# EAGLE design tracking-mode-analog-design (EAGLE 9.6.2)
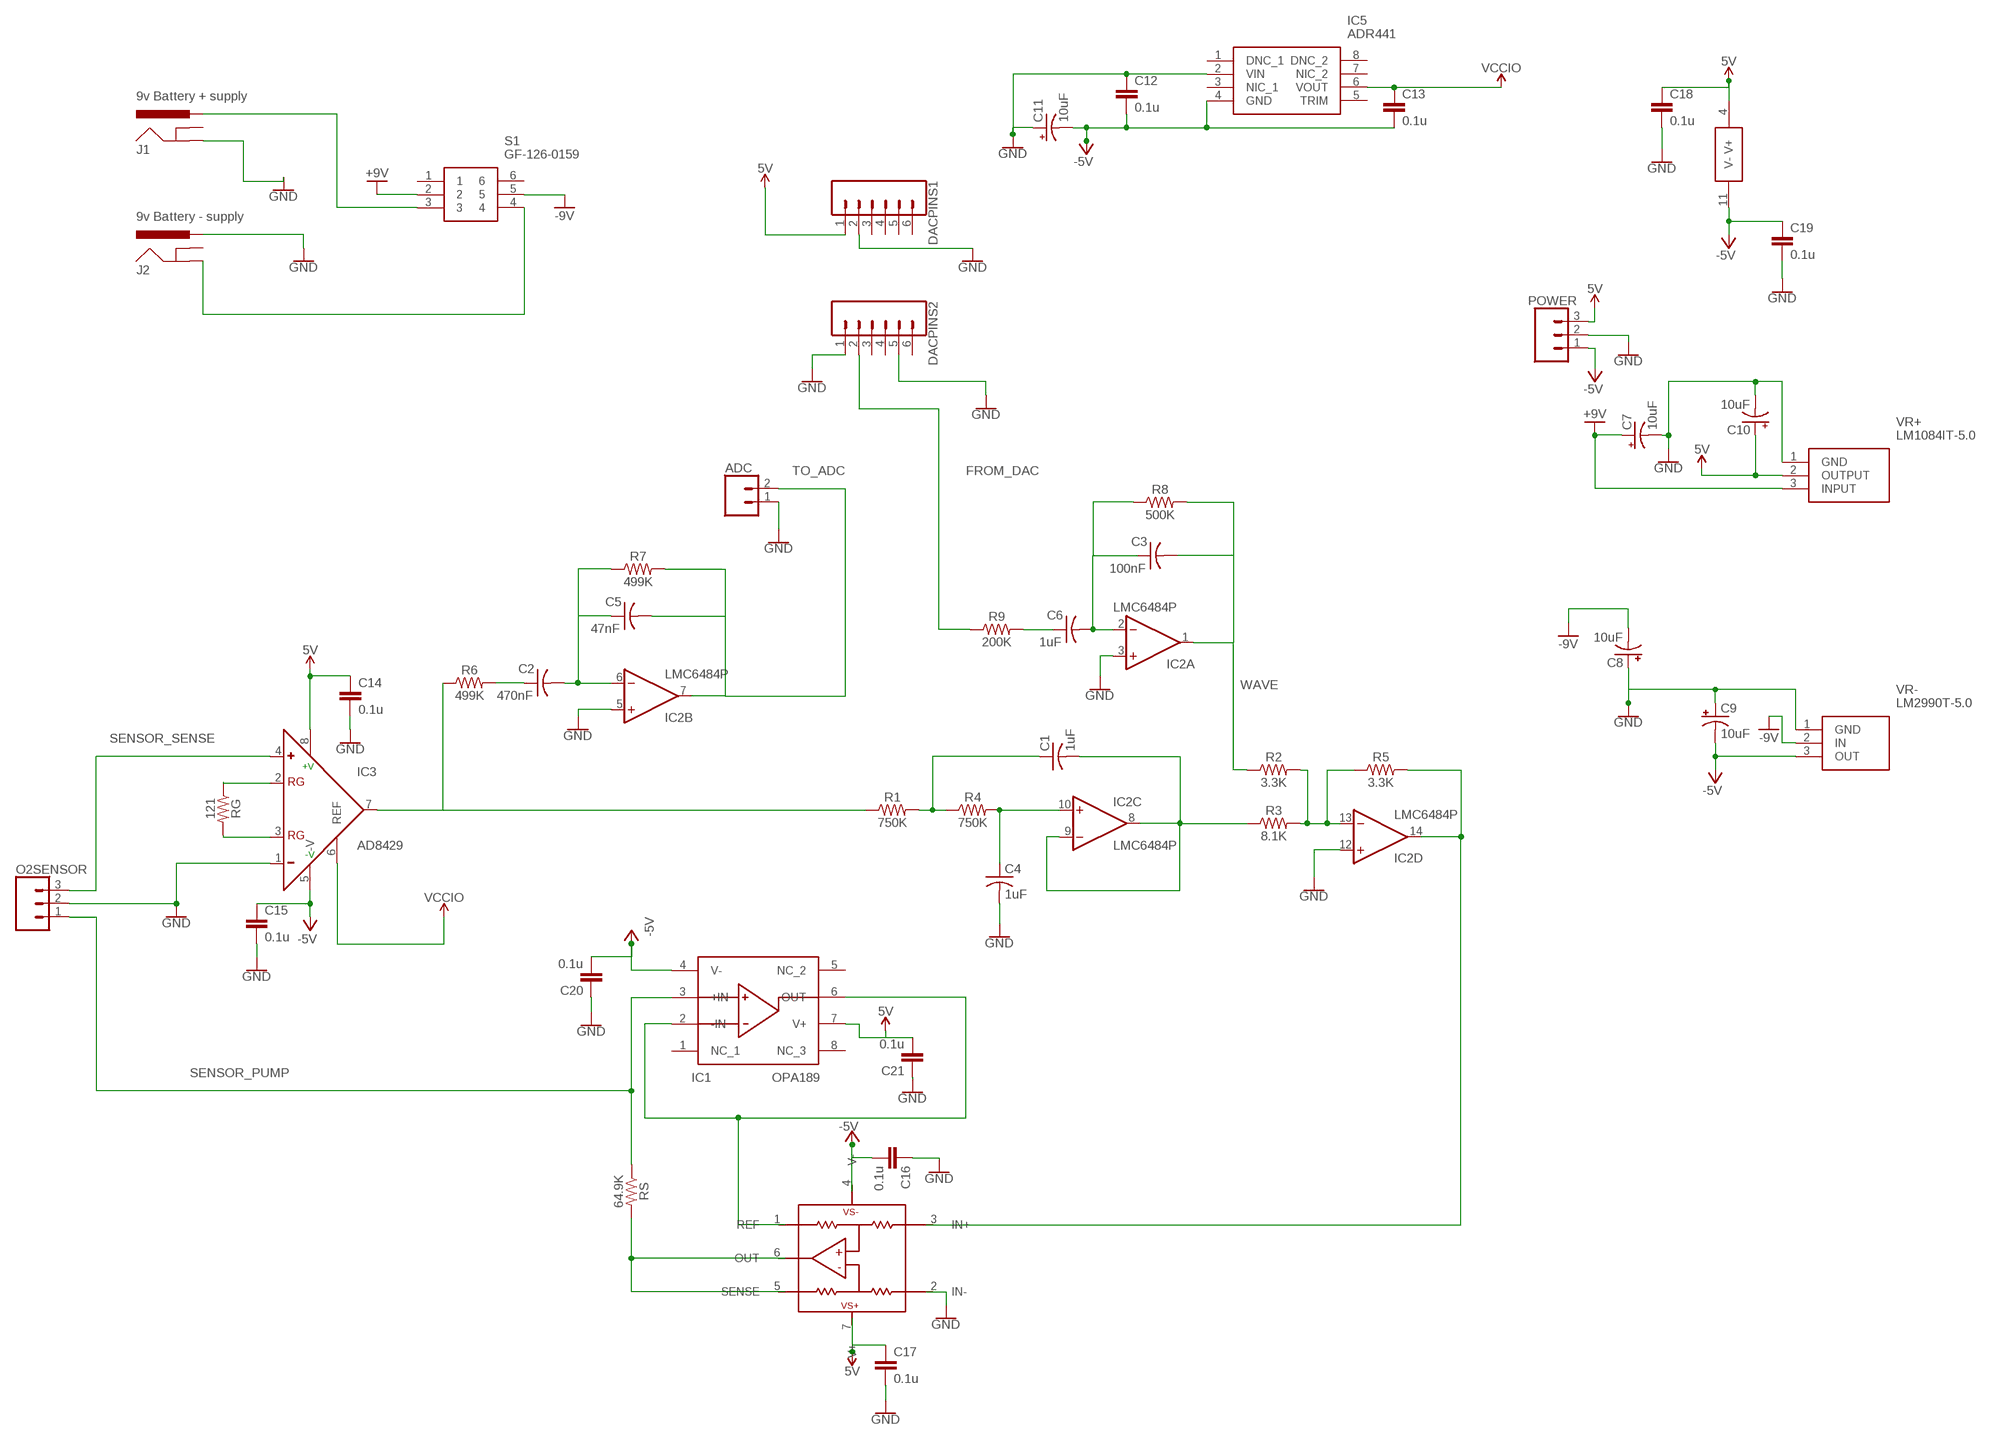
[diagram p0: schematic, sheet 1]

## Parts
ADC  CONN_02  [1X02]
C1  1uF  C-US025-030X050  [C025-030X050]
C2  470nF  C-US025-030X050  [C025-030X050]
C3  100nF  C-US025-030X050  [C025-030X050]
C4  1uF  C-US025-030X050  [C025-030X050]
C5  47nF  C-US025-030X050  [C025-030X050]
C6  1uF  C-US025-030X050  [C025-030X050]
C7  10uF  10UF-POLAR-RADIAL-2.5MM-KIT-25V-20%  [CPOL-RADIAL-2.5MM-5MM-KIT]
C8  10uF  10UF-POLAR-RADIAL-2.5MM-KIT-25V-20%  [CPOL-RADIAL-2.5MM-5MM-KIT]
C9  10uF  10UF-POLAR-RADIAL-2.5MM-KIT-25V-20%  [CPOL-RADIAL-2.5MM-5MM-KIT]
C10  10uF  10UF-POLAR-RADIAL-2.5MM-KIT-25V-20%  [CPOL-RADIAL-2.5MM-5MM-KIT]
C11  10uF  10UF-POLAR-RADIAL-2.5MM-KIT-25V-20%  [CPOL-RADIAL-2.5MM-5MM-KIT]
C12  0.1u  C-EU025-040X050  [C025-040X050]
C13  0.1u  C-EU025-040X050  [C025-040X050]
C14  0.1u  C-EU025-040X050  [C025-040X050]
C15  0.1u  C-EU025-040X050  [C025-040X050]
C16  0.1u  C-EU025-040X050  [C025-040X050]
C17  0.1u  C-EU025-040X050  [C025-040X050]
C18  0.1u  C-EU025-040X050  [C025-040X050]
C19  0.1u  C-EU025-040X050  [C025-040X050]
C20  0.1u  C-EU025-040X050  [C025-040X050]
C21  0.1u  C-EU025-040X050  [C025-040X050]
DACPINS1  CONN_06SILK_FEMALE_PTH  [1X06]
DACPINS2  CONN_06SILK_FEMALE_PTH  [1X06]
IC1  OPA189  OPA189ID  [SOIC127P600X175-8N]
IC2  LMC6484P  [DIL14]
IC3  AD8429  AD8429R  [SO8]
IC5  ADR441  ADR441ARZ  [SOIC127P600X175-8N]
INA592  INA592  [SO08]
J1  9v Battery + supply  POWER_JACKPTH_BREAD  [POWER_JACK_PTH_BREAD]
J2  9v Battery - supply  POWER_JACKPTH_BREAD  [POWER_JACK_PTH_BREAD]
O2SENSOR  CONN_03  [1X03]
POWER  CONN_03  [1X03]
R1  750K  RESISTORAXIAL-0.3  [AXIAL-0.3]
R2  3.3K  RESISTORAXIAL-0.3  [AXIAL-0.3]
R3  8.1K  RESISTORAXIAL-0.3  [AXIAL-0.3]
R4  750K  RESISTORAXIAL-0.3  [AXIAL-0.3]
R5  3.3K  RESISTORAXIAL-0.3  [AXIAL-0.3]
R6  499K  RESISTORAXIAL-0.3  [AXIAL-0.3]
R7  499K  RESISTORAXIAL-0.3  [AXIAL-0.3]
R8  500K  RESISTORAXIAL-0.3  [AXIAL-0.3]
R9  200K  RESISTORAXIAL-0.3  [AXIAL-0.3]
RG  121  RESISTORAXIAL-0.3  [AXIAL-0.3]
RS  64.9K  RESISTORAXIAL-0.3  [AXIAL-0.3]
S1  GF-126-0159  [GF1260159]
VR+  LM1084IT-5.0  LM1084IT-5.0_NOPB  [TO254P470X1028X1955-3P]
VR-  LM2990T-5.0  LM2990T-5.0_NOPB  [TO254P470X1028X1955-3P]

## Nets
5V: C10.1(+) C14.1 C17.1 C18.1 C21.2 DACPINS1.1 IC1.7(V+) IC2.4(P:V+) IC3.8(+V) INA592.7(V+) POWER.3 VR+.2(OUTPUT)
+V: C7.1(+) S1.2 VR+.3(INPUT) ; supply symbol labelled +9V
-5V: C9.2(-) C11.2(-) C12.2 C13.2 C15.1 C16.2 C19.1 C20.2 IC1.4(V-) IC2.11(P:V-) IC3.5(-V) IC5.4(GND) INA592.4(V-) POWER.1 VR-.3(OUT)
-V: C8.2(-) S1.5 VR-.2(IN) ; supply symbol labelled -9V
FROM_DAC: DACPINS2.2 R9.P$1
GND: ADC.1 C4.2 C7.2(-) C8.1(+) C9.1(+) C10.2(-) C11.1(+) C12.1 C14.2 C15.2 C16.1 C17.2 C18.2 C19.2 C20.1 C21.1 DACPINS1.2 DACPINS2.1 DACPINS2.5 IC2.3(A:+IN) IC2.5(B:+IN) IC2.12(D:+IN) IC3.1(-) IC5.2(VIN) INA592.2(IN-) J1.GND J2.PWR O2SENSOR.2 POWER.2 VR+.1(GND) VR-.1(GND)
N$1: C2.2 C5.1 IC2.6(B:-IN) R7.P$1
N$2: INA592.5(SENSE) INA592.6(OUT) RS.P$2
N$3: C2.1 R6.P$2
N$4: IC3.7(OUT) R1.P$1 R6.P$1
N$5: C1.1 R1.P$2 R4.P$1
N$6: C4.1 IC2.10(C:+IN) R4.P$2
N$7: C1.2 IC2.8(C:OUT) IC2.9(C:-IN) R3.P$1
N$8: IC2.13(D:-IN) R2.P$2 R3.P$2 R5.P$1
N$9: IC1.2(-IN) IC1.6(OUT) INA592.1(REF)
N$10: IC2.14(D:OUT) INA592.3(IN+) R5.P$2
N$11: C6.1 R9.P$2
N$12: IC3.2(RG) RG.P$1
N$13: C3.1 C6.2 IC2.2(A:-IN) R8.P$1
N$14: J2.GND S1.4
N$15: J1.PWR S1.3
N$16: IC3.3(RG) RG.P$2
SENSOR_PUMP: IC1.3(+IN) O2SENSOR.1 RS.P$1
SENSOR_SENSE: IC3.4(+) O2SENSOR.3
TO_ADC: ADC.2 C5.2 IC2.7(B:OUT) R7.P$2
VCCIO: C13.1 IC3.6(REF) IC5.6(VOUT)
WAVE: C3.2 IC2.1(A:OUT) R2.P$1 R8.P$2
Unconnected: DACPINS1.3 DACPINS1.4 DACPINS1.5 DACPINS1.6 DACPINS2.3 DACPINS2.4 DACPINS2.6 IC1.1(NC_1) IC1.5(NC_2) IC1.8(NC_3) IC5.1(DNC_1) IC5.3(NIC_1) IC5.5(TRIM) IC5.7(NIC_2) IC5.8(DNC_2) J1.GNDBREAK J2.GNDBREAK S1.1 S1.6

## Library data of the parts
ADC = SparkFun-Connectors:CONN_02: Multi connection point. Often used as Generic Header-pin footprint for 0.1 inch spaced/style header connections On any of the 0.1 inch spaced packages, you can populate with these: Break Away Headers - Straight <https://www.sparkfun.com/products/116> (PRT-00116) Break Away Male Headers - Right Angle <https://www.sparkfun.com/products/553> (PRT-00553) Female Headers <https://www.sparkfun.com/products/115> (PRT-00115) Break Away Headers - Machine Pin <https://www.sparkfun.com/products/117> (PRT-00117) Break Away Female Headers - Swiss Machine Pin <https://www.sparkfun.com/products/743> (PRT-00743) For SCREWTERMINALS and SPRING TERMINALS visit here: Screw Terimnals on SparkFun.com <https://www.sparkfun.com/search/results?term=Screw+Terminals> (5mm/3.5mm/2.54mm spacing) This device is also useful as a general connection point to wire up your design to another part of your project. Our various solder wires solder well into these plated through hole pads. Hook-Up Wire - Assortment (Stranded, 22 AWG) <https://www.sparkfun.com/products/11375> (PRT-11375) Hook-Up Wire - Assortment (Solid Core, 22 AWG) <https://www.sparkfun.com/products/11367> (PRT-11367) View the entire wire category on our website here <https://www.sparkfun.com/categories/141> Special notes: Molex polarized connector foot print use with: PRT-08233 with associated crimp pins and housings. 2.54_SCREWTERM for use with PRT-10571. 3.5mm Screw Terminal footprints for PRT-08084 5mm Screw Terminal footprints for use with PRT-08432
C1-C6 = adafruit:C-US: CAPACITOR, American symbol
C7-C11 = SparkFun-Capacitors:10UF-POLAR: 10.0µF polarized capacitors A capacitor is a passive two-terminal electrical component used to store electrical energy temporarily in an electric field.; PROD_ID: CAP-08440
C12-C21 = rcl:C-EU: CAPACITOR, European symbol; SPICEPREFIX: C
DACPINS1 DACPINS2 = SparkFun-Connectors:CONN_06: Multi connection point. Often used as Generic Header-pin footprint for 0.1 inch spaced/style header connections On any of the 0.1 inch spaced packages, you can populate with these: Break Away Headers - Straight <https://www.sparkfun.com/products/116> (PRT-00116) Break Away Male Headers - Right Angle <https://www.sparkfun.com/products/553> (PRT-00553) Female Headers <https://www.sparkfun.com/products/115> (PRT-00115) Break Away Headers - Machine Pin <https://www.sparkfun.com/products/117> (PRT-00117) Break Away Female Headers - Swiss Machine Pin <https://www.sparkfun.com/products/743> (PRT-00743) Arduino Stackable Header - 6 Pin <https://www.sparkfun.com/products/9280> (PRT-09280) Screw Terminals 2.54mm Pitch (6-Pin) <https://www.sparkfun.com/products/16499> (PRT-16499) For SCREWTERMINALS and SPRING TERMINALS visit here: Screw Terimnals on SparkFun.com <https://www.sparkfun.com/search/results?term=Screw+Terminals> (5mm/3.5mm/2.54mm spacing) This device is also useful as a general connection point to wire up your design to another part of your project. Our various solder wires solder well into these plated through hole pads. Hook-Up Wire - Assortment (Stranded, 22 AWG) <https://www.sparkfun.com/products/11375> (PRT-11375) Hook-Up Wire - Assortment (Solid Core, 22 AWG) <https://www.sparkfun.com/products/11367> (PRT-11367) View the entire wire category on our website here <https://www.sparkfun.com/categories/141>; PROD_ID: CONN-08437
IC1 = Annas_components:OPA189ID: 14MHz, MUX-Friendly, Low-noise, Zero-Drift, RRO, CMOS Precision Operational Amplifier Source: Datasheet <http://www.ti.com/lit/gpn/OPA189>; DESCRIPTION: 14MHz, MUX-Friendly, Low-noise, Zero-Drift, RRO, CMOS Precision Operational Amplifier; HEIGHT: 1.75mm; MANUFACTURER_NAME: Texas Instruments; MANUFACTURER_PART_NUMBER: OPA189ID; MOUSER_PART_NUMBER: 595-OPA189ID; MOUSER_PRICE-STOCK: https://www.mouser.co.uk/ProductDetail/Texas-Instruments/OPA189ID?qs=HXFqYaX1Q2yMqvbYDOJ0Ig%3D%3D
IC2 = Annas_components:LMC6484: OP AMP Standard quad package
IC3 = Annas_components:AD8429: Low Cost, Low Power, Instrumentation Amplifier Source: http://www.analog.com/UploadedFiles/Data_Sheets/37793330023930AD620_e.pdf; MPN: AD620AR; OC_FARNELL: 1464424; OC_NEWARK: 05F7109
IC5 = SamacSys_Parts:ADR441ARZ: Series Voltage Reference IC Fixed 2.5V V +/-0.12% 10 mA 8-SOIC Source: Datasheet <https://www.analog.com/media/en/technical-documentation/data-sheets/adr440_441_443_444_445.pdf>; DESCRIPTION: Series Voltage Reference IC Fixed 2.5V V +/-0.12% 10 mA 8-SOIC; HEIGHT: 1.75mm; MANUFACTURER_NAME: Analog Devices; MANUFACTURER_PART_NUMBER: ADR441ARZ; MOUSER_PART_NUMBER: 584-ADR441ARZ; MOUSER_PRICE-STOCK: https://www.mouser.co.uk/ProductDetail/Analog-Devices/ADR441ARZ?qs=WIvQP4zGanjF%252B9HT%2FrItQQ%3D%3D
INA592 = Annas_components:INA592
J1 J2 = SparkFun-Connectors_mod:POWER_JACK: Power Jack Connector This is the standard 5.5mm barrel jack for power. The PTH is the most common, proven, reliable, footprint. The Slot footprint only works if the mill layer is transmitted to the PCB fab house so be warned. Here are the connectors we sell at SparkFun: DC Barrel Power Jack/Connector <https://www.sparkfun.com/products/119> (PRT-00119) DC Barrel Power Jack/Connector (SMD) <https://www.sparkfun.com/products/12748> (PRT-12748) DC Barrel Jack Adapter - Breadboard Compatible <https://www.sparkfun.com/products/10811> (PRT-10811) It is used on this SparkFun product (and many, many others): SparkFun RedBoard - Programmed with Arduino <https://www.sparkfun.com/products/12757> (DEV-12757) Also, if you need a mating power supply or connector, please check these out: Wall Adapter Power Supply - 9VDC 650mA <https://www.sparkfun.com/products/298> (TOL-00298) DC Barrel Jack Adapter - Male <https://www.sparkfun.com/products/10287> (PRT-10287); PROD_ID: PRT-10811
O2SENSOR POWER = SparkFun-Connectors:CONN_03: Multi connection point. Often used as Generic Header-pin footprint for 0.1 inch spaced/style header connections On any of the 0.1 inch spaced packages, you can populate with these: Break Away Headers - Straight <https://www.sparkfun.com/products/116> (PRT-00116) Break Away Male Headers - Right Angle <https://www.sparkfun.com/products/553> (PRT-00553) Female Headers <https://www.sparkfun.com/products/115> (PRT-00115) Break Away Headers - Machine Pin <https://www.sparkfun.com/products/117> (PRT-00117) Break Away Female Headers - Swiss Machine Pin <https://www.sparkfun.com/products/743> (PRT-00743) Stackable Header - 3 Pin (Female, 0.1") <https://www.sparkfun.com/products/13875> (PRT-13875) For SCREWTERMINALS and SPRING TERMINALS visit here: Screw Terimnals on SparkFun.com <https://www.sparkfun.com/search/results?term=Screw+Terminals> (5mm/3.5mm/2.54mm spacing) This device is also useful as a general connection point to wire up your design to another part of your project. Our various solder wires solder well into these plated through hole pads. Hook-Up Wire - Assortment (Stranded, 22 AWG) <https://www.sparkfun.com/products/11375> (PRT-11375) Hook-Up Wire - Assortment (Solid Core, 22 AWG) <https://www.sparkfun.com/products/11367> (PRT-11367) View the entire wire category on our website here <https://www.sparkfun.com/categories/141> Special notes: Molex polarized connector foot print use with SKU : PRT-08232 with associated crimp pins and housings.
R1-R9 RG RS = SparkFun-Resistors:RESISTOR: Generic Resistor Package
S1 = SamacSys_Parts:GF-126-0159: Slide Switches MINATURE DPDT PC MT Source: Datasheet; DESCRIPTION: Slide Switches MINATURE DPDT PC MT; HEIGHT: 14.46mm; MANUFACTURER_NAME: CW Industries; MANUFACTURER_PART_NUMBER: GF-126-0159; MOUSER_PART_NUMBER: 629-GF1260159; MOUSER_PRICE-STOCK: https://www.mouser.co.uk/ProductDetail/CW-Industries/GF-126-0159?qs=YTF9U5lrlUnERgQKHbb2Jw%3D%3D
VR+ = SamacSys_Parts:LM1084IT-5.0_NOPB: 5A Fixed / Adjustable Output Linear Regulator Source: Datasheet <http://www.ti.com/lit/gpn/lm1084>; DESCRIPTION: 5A Fixed / Adjustable Output Linear Regulator; HEIGHT: 4.7mm; MANUFACTURER_NAME: Texas Instruments; MANUFACTURER_PART_NUMBER: LM1084IT-5.0/NOPB; MOUSER_PART_NUMBER: 926-LM1084IT50NOPB; MOUSER_PRICE-STOCK: https://www.mouser.co.uk/ProductDetail/Texas-Instruments/LM1084IT-5.0-NOPB?qs=X1J7HmVL2ZG3q7gVwoDmcw%3D%3D
VR- = SamacSys_Parts:LM2990T-5.0_NOPB: Texas Instruments LM2990T-5.0/NOPB, LDO Voltage Regulator, 1A, -5 V +/-5%, -26 0.3 Vin, 3-Pin TO-220 Source: Datasheet <http://www.ti.com/lit/gpn/lm2990>; DESCRIPTION: Texas Instruments LM2990T-5.0/NOPB, LDO Voltage Regulator, 1A, -5 V +/-5%, -26 0.3 Vin, 3-Pin TO-220; HEIGHT: 4.7mm; MANUFACTURER_NAME: Texas Instruments; MANUFACTURER_PART_NUMBER: LM2990T-5.0/NOPB; MOUSER_PART_NUMBER: 926-LM2990T-5.0/NOPB; MOUSER_PRICE-STOCK: https://www.mouser.co.uk/ProductDetail/Texas-Instruments/LM2990T-5.0-NOPB?qs=X1J7HmVL2ZF10%252BpsbiQQrQ%3D%3D

## Board
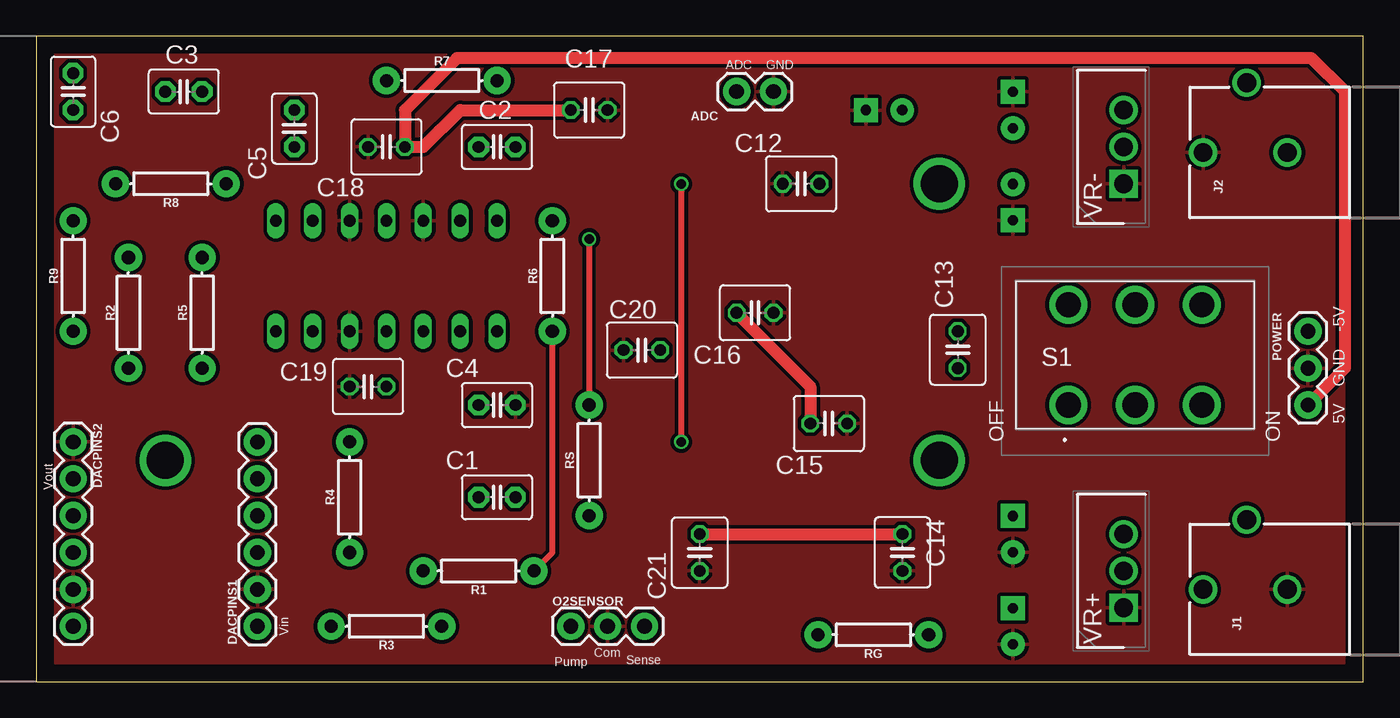
[diagram p1: board, top side]
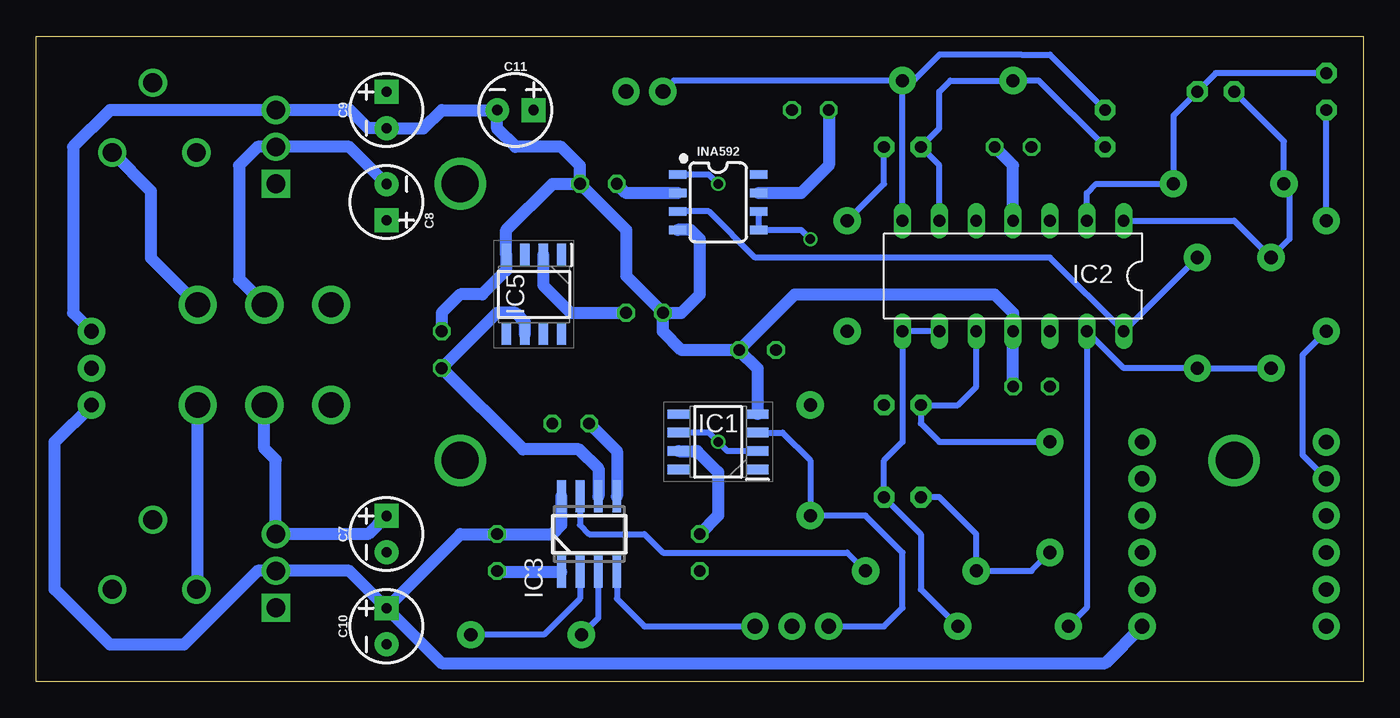
[diagram p2: board, bottom side, seen from below]

Size 91.44 x 44.45 mm. Coordinates in mm from the lower left corner, seen from the top.
Outline: 0,0 91.44,0 91.44,44.45 0,44.45 0,0
Copper layers (1*16): Top 0.035559375mm / dielectric 1.6mm / Bottom 0.035559375mm
Design rules "oshpark-2layer": minimum track width 6mil, minimum drill 10mil, track to track 6mil, track to pad 6mil, pad to pad 6mil, via to via 6mil, smd to smd 6mil, copper to edge 15mil, drill to drill 6mil, minimum pad ring 5mil, minimum via ring 5mil, stop-mask expansion 2.5mil, vias tented up to drill 0mil, thermal gap 10mil

### Footprints (pad centres in the part's own frame; a part is rotated, then mirrored left to right if it is on the bottom)
1X02 = drill 1.016 pad 1.88: 1 0,0; 2 2.54,0
C025-030X050 = drill 0.813 pad 1.422 octagon: 1 -1.27,0; 2 1.27,0
CPOL-RADIAL-2.5MM-5MM-KIT = drill 0.7 pad 1.651 square: 1 1.25,0 | drill 0.7 pad 1.651: 2 -1.25,0
C025-040X050 = drill 0.813 octagon: 1 -1.27,0; 2 1.27,0
1X06 = drill 1.016 pad 1.88: 1 0,0; 2 2.54,0; 3 5.08,0; 4 7.62,0; 5 10.16,0; 6 12.7,0
SOIC127P600X175-8N = smd 1.528 x 0.65: 1 -2.711,1.905; 2 -2.711,0.635; 3 -2.711,-0.635; 4 -2.711,-1.905; 5 2.711,-1.905; 6 2.711,-0.635; 7 2.711,0.635; 8 2.711,1.905
DIL14 = drill 0.813 long: 1 -7.62,-3.81; 2 -5.08,-3.81; 3 -2.54,-3.81; 4 0,-3.81; 5 2.54,-3.81; 6 5.08,-3.81; 7 7.62,-3.81; 8 7.62,3.81; 9 5.08,3.81; 10 2.54,3.81; 11 0,3.81; 12 -2.54,3.81; 13 -5.08,3.81; 14 -7.62,3.81
SO8 = smd 0.6 x 2.2: 1 -1.905,-2.6; 2 -0.635,-2.6; 3 0.635,-2.6; 4 1.905,-2.6; 5 1.905,2.6; 6 0.635,2.6; 7 -0.635,2.6; 8 -1.905,2.6
SOIC127P600X175-8N' = smd 1.525 x 0.65: 1 -2.712,1.905; 2 -2.712,0.635; 3 -2.712,-0.635; 4 -2.712,-1.905; 5 2.712,-1.905; 6 2.712,-0.635; 7 2.712,0.635; 8 2.712,1.905
SO08 = smd 0.6 x 1.2: 1 -1.905,-2.8; 2 -0.635,-2.8; 3 0.635,-2.8; 4 1.905,-2.8; 5 1.905,2.8; 6 0.635,2.8; 7 -0.635,2.8; 8 -1.905,2.8
POWER_JACK_PTH_BREAD = drill 1.3: GND 0,7.9; GNDBREAK 4.8,10.7; PWR 0,13.7
1X03 = drill 1.016 pad 1.88: 1 0,0; 2 2.54,0; 3 5.08,0
AXIAL-0.3 = drill 0.9 pad 1.88: P$1 -3.81,0; P$2 3.81,0
GF1260159 = drill 1.75 pad 2.625: 1 0,0; 2 4.6,0; 3 9.2,0; 4 9.2,6.91; 5 4.6,6.91; 6 0,6.91
TO254P470X1028X1955-3P = drill 1.29 pad 1.935 square: 1 0,0 | drill 1.29 pad 1.935: 2 2.54,0; 3 5.08,0

### Placement (x,y rotation side)
ADC  50.8,40.64 180 top
C1  31.75,12.7 0 top
C2  31.75,36.83 180 top
C3  10.16,40.64 180 top
C4  31.75,19.05 0 top
C5  17.78,38.1 90 top
C6  2.54,40.64 90 top
C7  67.31,10.16 90 bottom
C8  67.31,33.02 270 bottom
C9  67.31,39.37 90 bottom
C10  67.31,3.81 90 bottom
C11  58.42,39.37 0 bottom
C12  52.7,34.29 0 top
C13  63.5,22.86 90 top
C14  59.69,8.89 270 top
C15  54.61,17.78 0 top
C16  49.53,25.4 180 top
C17  38.1,39.37 0 top
C18  24.13,36.83 180 top
C19  22.86,20.32 180 top
C20  41.73,22.83 0 top
C21  45.72,8.89 90 top
DACPINS1  15.24,3.81 90 top
DACPINS2  2.54,16.51 270 top
IC1  44.45,16.51 180 bottom
IC2  24.13,27.94 180 bottom
IC3  53.34,10.16 0 bottom
IC5  ADR441  [SOIC127P600X175-8N']  57.15,26.67 270 bottom
INA592  44.45,33.02 270 bottom
J1  94.11,6.35 90 top
J2  94.11,36.45 90 top
O2SENSOR  36.83,3.81 0 top
POWER  87.63,24.13 270 top
R1  30.48,7.62 180 top
R2  6.35,25.4 270 top
R3  24.13,3.81 180 top
R4  21.59,12.7 90 top
R5  11.43,25.4 90 top
R6  35.56,27.94 90 top
R7  27.94,41.4 0 top
R8  9.27,34.29 180 top
R9  2.54,27.94 90 top
RG  57.68,3.23 180 top
RS  38.1,15.24 90 top
S1  71.12,19.05 0 top
VR+  74.93,5.08 90 top
VR-  74.93,34.29 90 top

### Tracks (layer width: path | path; a pad name or v marks a point on that pad's centre or on a via)
5V
  Top 0.813: POWER.3 90.2,21.62 90.2,40.62 87.86,42.95 28.98,42.95 25.4,39.37 C18.1 26.67,36.83 29.21,39.37 C17.1 | C21.2 C14.1
  Bottom 0.813: C10.1 69.87,7.62 VR+.2 76.2,7.62 81.28,2.54 86.36,2.54 90.17,6.35 90.17,16.51 POWER.3 | C10.1 62.21,10.16 C14.1 55.88,10.16 55.25,10.8 IC3.8 | IC1.7 45.9,15.88 44.45,14.43 44.45,11.43 C21.2 | C18.1 24.13,35.56 IC2.4 | DACPINS1.1 17.78,1.27 63.52,1.27 C10.1 | C17.1 36.83,35.56 38.73,33.66 INA592.7
+V
  Bottom 0.813: C7.1 67.33,11.41 68.58,10.16 VR+.3 74.93,15.27 75.72,16.05 S1.2
-5V
  Top 0.813: C15.1 53.34,20.32 C16.2
  Bottom 0.813: IC3.5 51.44,15.88 C15.1 | C12.2 55.88,34.29 59.06,31.12 IC5.4 59.06,28.32 60.71,26.67 62.23,26.67 63.5,25.4 C13.2 | C12.2 53.98,35.54 55.27,36.83 58.42,36.83 59.67,38.08 C11.2 63.5,39.37 64.77,38.1 67.29,38.1 C9.2 68.58,38.12 69.85,39.39 74.91,39.39 VR-.3 86.36,39.37 88.9,36.83 88.9,25.4 POWER.1 | C12.2 50.8,31.12 50.8,27.94 C16.2 | C16.2 46.99,25.4 45.72,26.67 45.72,30.48 46.36,31.12 INA592.4 | C16.2 48.26,24.13 46.97,22.84 C20.2 | C19.1 IC2.11 24.13,25.4 25.4,26.67 39.17,26.67 C20.2 | C20.2 41.74,21.57 IC1.4
-V
  Bottom 0.813: S1.5 77.47,27.71 77.47,35.56 76.2,36.83 VR-.2 69.87,36.83 C8.2
FROM_DAC
  Bottom 0.406: DACPINS2.2 4.19,15.62 4.19,22.48 R9.P$1
GND
  Bottom 0.813: C14.2 59.63,7.56 IC3.1 | INA592.2 50.8,33.66 C12.1 | IC5.2 56.52,27.3 54.61,25.4 C16.1
  pour Top (isolate 0.254): 90.17,1.27 90.17,43.18 1.27,43.18 1.27,1.27
N$1
  Bottom 0.406: IC2.6 29.21,35.56 C2.2 29.21,38.1 29.21,40.64 28.45,41.4 R7.P$1 22.35,41.4 C5.1
N$2  (via drill 0.65)
  Top 0.406: v38.1,30.48 RS.P$2
  Bottom 0.406: v38.1,30.48 38.73,31.12 INA592.5 INA592.6
N$3
  Bottom 0.406: R6.P$2 33.02,34.29 C2.1
N$4
  Top 0.406: R1.P$1 35.56,8.89 R6.P$1
  Bottom 0.406: R1.P$1 35.56,8.89 48.26,8.89 49.53,10.16 50.8,10.16 | IC3.7 53.98,10.8 53.34,10.16 50.8,10.16 | 50.8,10.16
N$5
  Bottom 0.406: R4.P$1 22.86,7.62 R1.P$2 26.67,10.16 29.21,12.7 C1.1
N$6
  Bottom 0.406: R4.P$2 29.21,16.51 30.48,17.78 C4.1 27.94,19.05 26.67,20.32 IC2.10
N$7
  Bottom 0.406: R3.P$1 30.48,6.35 30.48,10.16 C1.2 33.02,15.24 31.75,16.51 IC2.8 IC2.9
N$8
  Bottom 0.406: R3.P$2 19.05,5.08 IC2.13 16.51,21.59 R5.P$1 R2.P$2
N$9  (via drill 0.65)
  Top 0.406: v44.45,16.51 v44.45,34.29
  Bottom 0.406: IC1.2 43.81,15.88 v44.45,16.51 45.09,17.14 IC1.6 | v44.45,34.29 45.09,34.93 INA592.1
N$10
  Bottom 0.406: R5.P$2 IC2.14 21.59,29.21 41.91,29.21 45.09,32.38 INA592.3
N$11
  Bottom 0.406: R9.P$2 C6.1
N$12
  Bottom 0.406: IC3.2 53.98,5.72 56.46,3.23 RG.P$1
N$13
  Bottom 0.406: IC2.2 19.05,33.66 18.42,34.29 R8.P$1 13.08,38.99 C3.1 10.16,41.91 C6.2
N$14
  Bottom 0.813: J2.GND 83.54,33.78 83.54,29.18 S1.4
N$15
  Bottom 0.813: J1.PWR 80.32,6.44 S1.3
N$16
  Bottom 0.406: RG.P$2 52.7,4.39 IC3.3
N$17  (via drill 2.54)
  other vias: 8.89,15.24
N$18  (via drill 2.54)
  other vias: 62.23,15.24
N$19  (via drill 2.54)
  other vias: 62.23,34.29
SENSOR_PUMP
  Bottom 0.406: IC1.3 40.01,17.14 38.1,15.24 RS.P$1 34.29,11.43 31.75,8.89 31.75,5.08 33.02,3.81 O2SENSOR.1
SENSOR_SENSE
  Bottom 0.406: IC3.4 51.44,5.72 49.53,3.81 O2SENSOR.3
TO_ADC
  Bottom 0.406: R7.P$2 47.5,41.4 ADC.2 | IC2.7 R7.P$2 | R7.P$2 30.99,41.4 29.19,43.2 23.59,43.2 23.57,43.18 21.59,43.18 C5.2
VCCIO
  Bottom 0.813: IC3.6 52.7,14.68 54.03,16 57.91,16 C13.1 59.69,25.4 58.42,25.4 57.79,24.77 IC5.6
WAVE
  Bottom 0.406: IC2.1 8.89,31.75 R2.P$1 5.08,30.48 5.08,33.91 R8.P$2 5.46,37.21 C3.2

### Text on the board
tPlace: ADC | -5V | GND | 5V | OFF | ON | Com | Pump | Sense
tNames: GND | Vout | Vin